# Altium schematic sheet can_unisolated.SchDoc
size A4
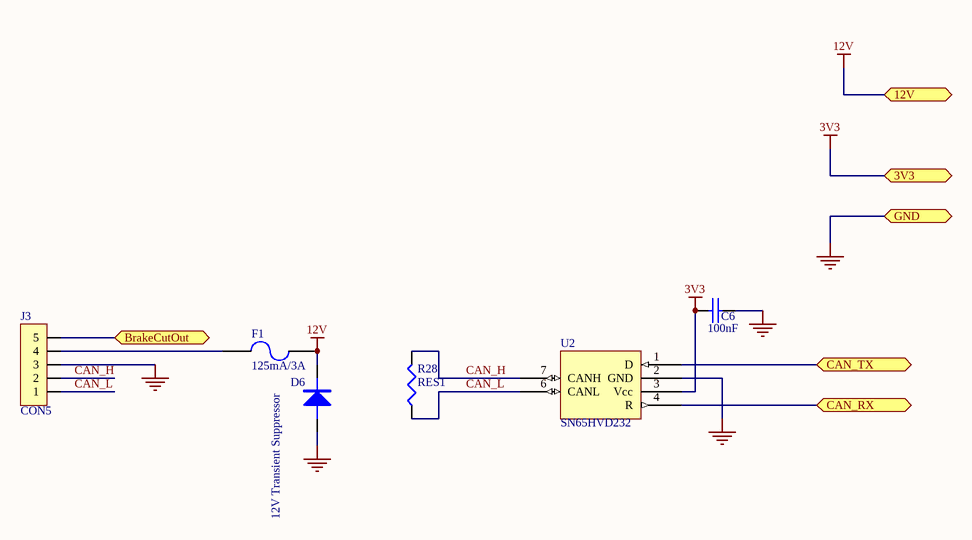
[diagram p0: can_unisolated.SchDoc]

## Parts
C6  100nF  [0603]
D6  12V Transient Suppressor  [SMA]
F1  125mA/3A  [LITTELFUSE-154]
J3  CON5  [ENG.1B.305.CLL]
R28  RES1  [0603]
U2  SN65HVD232  [SO8]

## Ports
3V3, 12V, BrakeCutOut, CAN_RX, CAN_TX, GND

## Nets
3V3: C6.2 U2.3(Vcc) ; port 3V3
12V: D6.K F1.2 ; port 12V
GND: C6.1 D6.A J3.3 U2.2(GND) ; port GND
BrakeCutOut: J3.5 ; port BrakeCutOut
CAN_H: J3.2 R28.2 U2.7(CANH)
CAN_L: J3.1 R28.1 U2.6(CANL)
CAN_RX: U2.4(R) ; port CAN_RX
CAN_TX: U2.1(D) ; port CAN_TX
NetF1_1: F1.1 J3.4

## Library data of the parts
C6 = CAP: Capacitor; Order#: 753-567; Price: 0.31; Supplier: Farnell
D6 = DIODE: Order#: 980-2754; Price: 1.25; Supplier: Farnell
F1 = FUSE2: Fuse; Order#: 994-3609; Other Info: www.littelfuse.com; Price: 7.78; Supplier: Farnell
J3 = CON5: Connector; RS: 173-2578
R28 = RES1: Resistor
U2 = SN65HVD232: 3.3V CAN Transciever; Order#: 296-12282-5-ND; Supplier: Digikey; Price: 2.93